# EasyEDA schematic SCH_UWB_AiThinker_BU01_2023-06-05.json
TITLE: Sheet_1; REV: 1.0; Date: 2023-04-06; Sheet: 1/1; Drawn By: zlz9sq; Company: Your Company
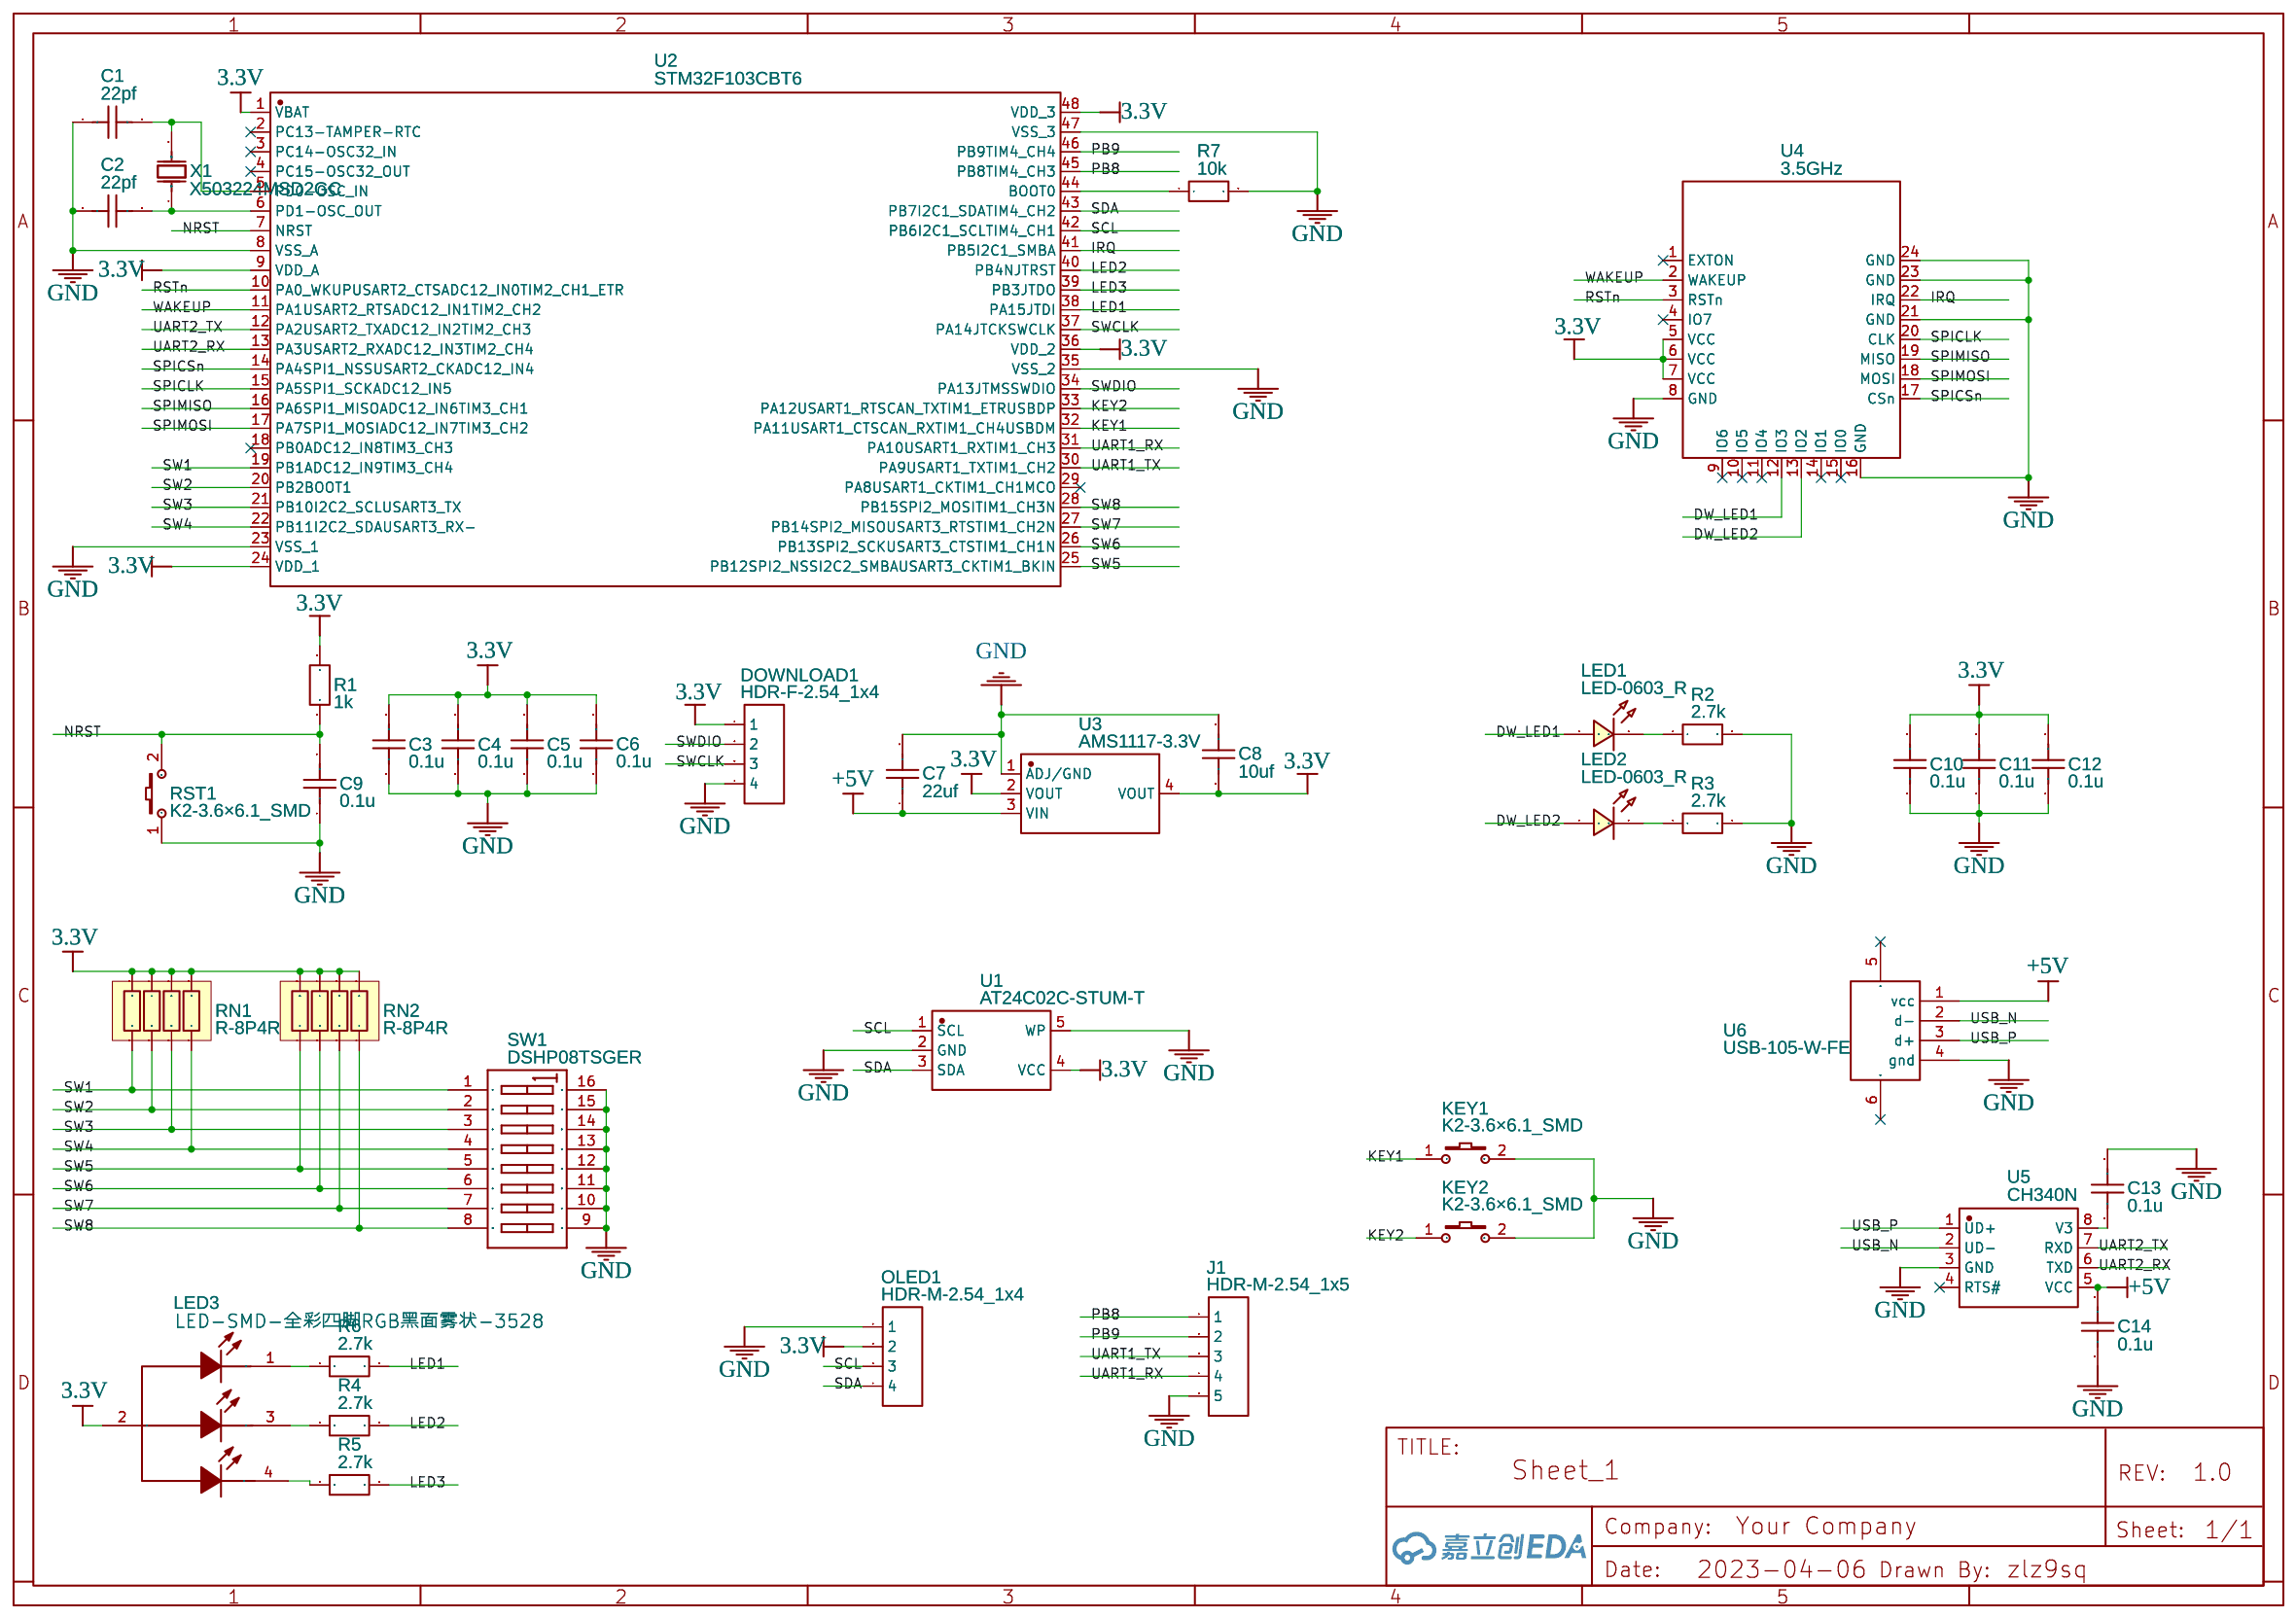
[diagram p0: schematic sheet]

## Parts
C1  22pf  [C0603]
C2  22pf  [C0603]
C3  0.1u  [C0603]
C4  0.1u  [C0603]
C5  0.1u  [C0603]
C6  0.1u  [C0603]
C7  22uf  [C0603]
C8  10uf  [C0603]
C9  0.1u  [C0603]
C10  0.1u  [C0603]
C11  0.1u  [C0603]
C12  0.1u  [C0603]
C13  0.1u  [C0603]
C14  0.1u  [C0603]
DOWNLOAD1  HDR-F-2.54_1x4  [HDR-F-2.54_1X4]
J1  HDR-M-2.54_1x5  [HDR-M-2.54_1X5]
KEY1  K2-3.6×6.1_SMD  [KEY-SMD_2P-L4.0-W3.0-P4.20]
KEY2  K2-3.6×6.1_SMD  [KEY-SMD_2P-L4.0-W3.0-P4.20]
LED1  LED-0603_R  [LED0603_RED]
LED2  LED-0603_R  [LED0603_RED]
LED3  LED-SMD-全彩四脚RGB黑面雾状-3528  [LED-SMD_FM-3528RGBA-HF]
OLED1  HDR-M-2.54_1x4  [HDR-M-2.54_1X4]
R1  1k  [R0603]
R2  2.7k  [R0603]
R3  2.7k  [R0603]
R4  2.7k  [R0603]
R5  2.7k  [R0603]
R6  2.7k  [R0603]
R7  10k  [R0603]
RN1  R-8P4R  [RCA-8P4R-0603]
RN2  R-8P4R  [RCA-8P4R-0603]
RST1  K2-3.6×6.1_SMD  [KEY-SMD_2P-L4.0-W3.0-P4.20]
SW1  DSHP08TSGER  [SWITCH-KE-8BIT/1.27_SMD]
U1  AT24C02C-STUM-T  [SOT-23-5_L3.0-W1.7-P0.95-LS2.8-BR]
U2  STM32F103CBT6  [LQFP-48_L7.0-W7.0-P0.50-LS9.0-BL]
U3  AMS1117-3.3V  [SOT-223-4_L6.5-W3.5-P2.30-LS7.0-BR]
U4  3.5GHz  [COMM-SMD_BU01]
U5  CH340N  [SOP-8_L5.0-W4.0-P1.27-LS6.0-BL]
U6  USB-105-W-FE  [USB-A-SMD_USB-105-W-FE]
X1  X503224MSD2GC  [CRYSTAL-SMD_L5.0-W3.2]

## Library data of the parts
C1-C6 C9-C14 = C_0603_US: Contributor: LCEDA_Lib
C7 C8 = C_0805_US: Contributor: LCEDA_Lib
DOWNLOAD1 = HDR-F-2.54_1x4: Supplier Part: C225501; Supplier: LCSC; Contributor: LCEDA_Lib
J1 = HDR-M-2.54_1x5: Supplier Part: C358687; Supplier: LCSC; Contributor: LCEDA_Lib
KEY1 KEY2 RST1 = K2-3.6×6.1_SMD: Supplier Part: C118141; Supplier: LCSC; Manufacturer Part: K2-1107ST-A4SW-06; Contributor: LCEDA_Lib; 制造商: 韩国韩荣
LED1 LED2 = LED-0603_R: Manufacturer: EVERLIGHT(台湾亿光); Manufacturer Part: 19-217/R6C-AL1M2VY/3T; Supplier Part: C72044; Supplier: LCSC; Contributor: LCEDA_01
LED3 = LED-SMD-全彩四脚RGB黑面雾状-3528: Supplier: LCSC; Supplier Part: C9900014091; Manufacturer: null; link: https://img.jlc.com/pdf/applyPasteComponent/2022-04-13/915731Y/a8cd99e858ab4b65bf0f12df1607abd3/3528RGBW4%E8%84%9A.pdf; Contributor: lcsc; JLCPCB Part Class: Extended Part
OLED1 = HDR-M-2.54_1x4: Supplier Part: C124378; Supplier: LCSC; Contributor: LCEDA_Lib
R1-R7 = R_0603_EU: Contributor: LCEDA_Lib
RN1 RN2 = R-8P4R: ___: __Ƭ________; __Ȩ____: Դ____; ѧϰ__Դ: www.ooocke.com; Contributor: FJ-51
SW1 = DSHP08TSGER: Supplier: LCSC; Manufacturer: KE; image: //image.lceda.cn/szlcsc/C40738.jpg; Supplier Part: C40738; Contributor: pcli218
U1 = AT24C02C-STUM-T: Supplier: LCSC; Manufacturer: MICROCHIP(美国微芯); Contributor: LCSC; Supplier Part: C94534; JLCPCB Part Class: Extended Part
U2 = STM32F103CBT6: Supplier: LCSC; Manufacturer: ST(意法半导体); Supplier Part: C8304; JLCPCB Part Class: Extended Part
U3 = AMS1117-3.3V: Supplier: LCSC; Supplier Part: C2688239; Manufacturer: WPMtek(维攀微); Contributor: LCSC; JLCPCB Part Class: Extended Part
U4 = BU01: Supplier: LCSC; Supplier Part: C503604; Manufacturer: Ai-Thinker(安信可); Contributor: LCSC; JLCPCB Part Class: Extended Part
U5 = CH340N: Supplier: LCSC; Supplier Part: C506813; Manufacturer: WCH(南京沁恒); Contributor: LCSC; JLCPCB Part Class: Extended Part
U6 = USB-105-W-FE: Supplier: LCSC; Supplier Part: C2939555; Manufacturer: HOOYA(皓宇电子); link: https://atta.szlcsc.com/upload/public/pdf/source/20220124/7557B274F68A7E7D36EB6ED311B43CCF.pdf; Contributor: lcsc; JLCPCB Part Class: Extended Part
X1 = X503224MSD2GC: Supplier Part: C48304; Supplier: LCSC; Manufacturer: null; JLCPCB Part Class: Extended Part

## Nets
3.3V: C3.2 C4.2 C5.2 C6.2 C8.2 C10.2 C11.2 C12.2 DOWNLOAD1.1 LED3.2 OLED1.2 R1.2 RN1.5 RN1.6 RN1.7 RN1.8 RN2.5 RN2.6 RN2.7 RN2.8 U1.4(VCC) U2.1(VBAT) U2.9(VDD_A) U2.24(VDD_1) U2.36(VDD_2) U2.48(VDD_3) U3.2(VOUT) U3.4(VOUT) U4.5(VCC) U4.6(VCC) U4.7(VCC)
+5V: C7.1 C14.2 U3.3(VIN) U5.5(VCC) U6.1(vcc)
GND: C1.1 C2.1 C3.1 C4.1 C5.1 C6.1 C7.2 C8.1 C9.1 C10.1 C11.1 C12.1 C13.2 C14.1 DOWNLOAD1.4 J1.5 KEY1.2 KEY2.2 OLED1.1 R2.2 R3.2 R7.2 RST1.1 SW1.9(B8) SW1.10(B7) SW1.11(B6) SW1.12(B5) SW1.13(B4) SW1.14(B3) SW1.15(B2) SW1.16(B1) U1.2(GND) U1.5(WP) U2.8(VSS_A) U2.23(VSS_1) U2.35(VSS_2) U2.47(VSS_3) U3.1(ADJ/GND) U4.8(GND) U4.16(GND) U4.21(GND) U4.23(GND) U4.24(GND) U5.3(GND) U6.4(gnd)
DW_LED1: LED1.1 U4.12(IO3)
DW_LED2: LED2.1 U4.13(IO2)
IRQ: U2.41(PB5I2C1_SMBA) U4.22(IRQ)
KEY1: KEY1.1 U2.32(PA11USART1_CTSCAN_RXTIM1_CH4USBDM)
KEY2: KEY2.1 U2.33(PA12USART1_RTSCAN_TXTIM1_ETRUSBDP)
LED1: R6.2 U2.38(PA15JTDI)
LED2: R4.2 U2.40(PB4NJTRST)
LED3: R5.2 U2.39(PB3JTDO)
NRST: C9.2 R1.1 RST1.2 U2.7(NRST)
PB8: J1.1 U2.45(PB8TIM4_CH3)
PB9: J1.2 U2.46(PB9TIM4_CH4)
RSTn: U2.10(PA0_WKUPUSART2_CTSADC12_IN0TIM2_CH1_ETR) U4.3(RSTn)
SCL: OLED1.3 U1.1(SCL) U2.42(PB6I2C1_SCLTIM4_CH1)
SDA: OLED1.4 U1.3(SDA) U2.43(PB7I2C1_SDATIM4_CH2)
SPICLK: U2.15(PA5SPI1_SCKADC12_IN5) U4.20(CLK)
SPICSn: U2.14(PA4SPI1_NSSUSART2_CKADC12_IN4) U4.17(CSn)
SPIMISO: U2.16(PA6SPI1_MISOADC12_IN6TIM3_CH1) U4.19(MISO)
SPIMOSI: U2.17(PA7SPI1_MOSIADC12_IN7TIM3_CH2) U4.18(MOSI)
SW1: RN1.1 SW1.1(A1) U2.19(PB1ADC12_IN9TIM3_CH4)
SW2: RN1.2 SW1.2(A2) U2.20(PB2BOOT1)
SW3: RN1.3 SW1.3(A3) U2.21(PB10I2C2_SCLUSART3_TX)
SW4: RN1.4 SW1.4(A4) U2.22(PB11I2C2_SDAUSART3_RX-)
SW5: RN2.1 SW1.5(A5) U2.25(PB12SPI2_NSSI2C2_SMBAUSART3_CKTIM1_BKIN)
SW6: RN2.2 SW1.6(A6) U2.26(PB13SPI2_SCKUSART3_CTSTIM1_CH1N)
SW7: RN2.3 SW1.7(A7) U2.27(PB14SPI2_MISOUSART3_RTSTIM1_CH2N)
SW8: RN2.4 SW1.8(A8) U2.28(PB15SPI2_MOSITIM1_CH3N)
SWCLK: DOWNLOAD1.3 U2.37(PA14JTCKSWCLK)
SWDIO: DOWNLOAD1.2 U2.34(PA13JTMSSWDIO)
UART1_RX: J1.4 U2.31(PA10USART1_RXTIM1_CH3)
UART1_TX: J1.3 U2.30(PA9USART1_TXTIM1_CH2)
UART2_RX: U2.13(PA3USART2_RXADC12_IN3TIM2_CH4) U5.6(TXD)
UART2_TX: U2.12(PA2USART2_TXADC12_IN2TIM2_CH3) U5.7(RXD)
USB_N: U5.2(UD-) U6.2(d-)
USB_P: U5.1(UD+) U6.3(d+)
WAKEUP: U2.11(PA1USART2_RTSADC12_IN1TIM2_CH2) U4.2(WAKEUP)
Net-(C1-2): C1.2 U2.5(PD0-OSC_IN) X1.2(OSC2)
Net-(C2-2): C2.2 U2.6(PD1-OSC_OUT) X1.1(OSC1)
Net-(C13-1): C13.1 U5.8(V3)
Net-(LED1-2): LED1.2 R2.1
Net-(LED2-2): LED2.2 R3.1
Net-(LED3-1): LED3.1(R) R6.1
Net-(LED3-3): LED3.3(B) R4.1
Net-(LED3-4): LED3.4(G) R5.1
Net-(R7-1): R7.1 U2.44(BOOT0)

Not connected (* = marked no-connect by the designer): U2 2(PC13-TAMPER-RTC)* 3(PC14-OSC32_IN)* 4(PC15-OSC32_OUT)* 18(PB0ADC12_IN8TIM3_CH3)* 29(PA8USART1_CKTIM1_CH1MCO)*; U4 1(EXTON)* 4(IO7)* 9(IO6)* 10(IO5)* 11(IO4)* 14(IO1)* 15(IO0)*; U5 4(RTS#)*; U6 5* 6*
